# Altium schematic sheet SH11 - Battery Balancing.SchDoc: Active Cell Balancing Circuit
size 279 x 215 mm
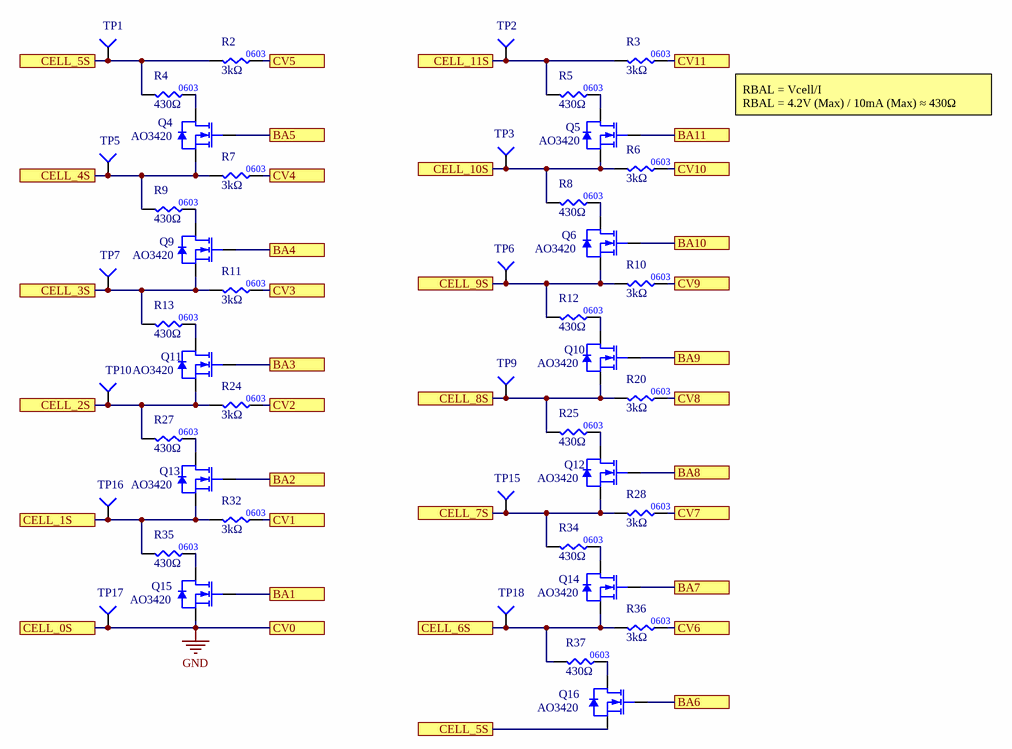
[diagram p0: SH11 - Battery Balancing.SchDoc]

## Parts
Q4  Manufacturer Part Number 1: AO3420  [SOT23-3]  (hidden comment: NMOS_20V_6A)
Q5  Manufacturer Part Number 1: AO3420  [SOT23-3]  (hidden comment: NMOS_20V_6A)
Q6  Manufacturer Part Number 1: AO3420  [SOT23-3]  (hidden comment: NMOS_20V_6A)
Q9  Manufacturer Part Number 1: AO3420  [SOT23-3]  (hidden comment: NMOS_20V_6A)
Q10  Manufacturer Part Number 1: AO3420  [SOT23-3]  (hidden comment: NMOS_20V_6A)
Q11  Manufacturer Part Number 1: AO3420  [SOT23-3]  (hidden comment: NMOS_20V_6A)
Q12  Manufacturer Part Number 1: AO3420  [SOT23-3]  (hidden comment: NMOS_20V_6A)
Q13  Manufacturer Part Number 1: AO3420  [SOT23-3]  (hidden comment: NMOS_20V_6A)
Q14  Manufacturer Part Number 1: AO3420  [SOT23-3]  (hidden comment: NMOS_20V_6A)
Q15  Manufacturer Part Number 1: AO3420  [SOT23-3]  (hidden comment: NMOS_20V_6A)
Q16  Manufacturer Part Number 1: AO3420  [SOT23-3]  (hidden comment: NMOS_20V_6A)
R2  value 3kΩ  [RES0603]  (hidden comment: RES_3kΩ_0603_1%)
R3  value 3kΩ  [RES0603]  (hidden comment: RES_3kΩ_0603_1%)
R4  value 430Ω  [RES0603]  (hidden comment: RES_430Ω_0603_5%)
R5  value 430Ω  [RES0603]  (hidden comment: RES_430Ω_0603_5%)
R6  value 3kΩ  [RES0603]  (hidden comment: RES_3kΩ_0603_1%)
R7  value 3kΩ  [RES0603]  (hidden comment: RES_3kΩ_0603_1%)
R8  value 430Ω  [RES0603]  (hidden comment: RES_430Ω_0603_5%)
R9  value 430Ω  [RES0603]  (hidden comment: RES_430Ω_0603_5%)
R10  value 3kΩ  [RES0603]  (hidden comment: RES_3kΩ_0603_1%)
R11  value 3kΩ  [RES0603]  (hidden comment: RES_3kΩ_0603_1%)
R12  value 430Ω  [RES0603]  (hidden comment: RES_430Ω_0603_5%)
R13  value 430Ω  [RES0603]  (hidden comment: RES_430Ω_0603_5%)
R20  value 3kΩ  [RES0603]  (hidden comment: RES_3kΩ_0603_1%)
R24  value 3kΩ  [RES0603]  (hidden comment: RES_3kΩ_0603_1%)
R25  value 430Ω  [RES0603]  (hidden comment: RES_430Ω_0603_5%)
R27  value 430Ω  [RES0603]  (hidden comment: RES_430Ω_0603_5%)
R28  value 3kΩ  [RES0603]  (hidden comment: RES_3kΩ_0603_1%)
R32  value 3kΩ  [RES0603]  (hidden comment: RES_3kΩ_0603_1%)
R34  value 430Ω  [RES0603]  (hidden comment: RES_430Ω_0603_5%)
R35  value 430Ω  [RES0603]  (hidden comment: RES_430Ω_0603_5%)
R36  value 3kΩ  [RES0603]  (hidden comment: RES_3kΩ_0603_1%)
R37  value 430Ω  [RES0603]  (hidden comment: RES_430Ω_0603_5%)
TP1  TESTPOINT_1MM_SQUARE  [TESTPOINT_SQUARE_1MM]  (value not drawn)  (no BOM)
TP2  TESTPOINT_1MM_SQUARE  [TESTPOINT_SQUARE_1MM]  (value not drawn)  (no BOM)
TP3  TESTPOINT_1MM_SQUARE  [TESTPOINT_SQUARE_1MM]  (value not drawn)  (no BOM)
TP5  TESTPOINT_1MM_SQUARE  [TESTPOINT_SQUARE_1MM]  (value not drawn)  (no BOM)
TP6  TESTPOINT_1MM_SQUARE  [TESTPOINT_SQUARE_1MM]  (value not drawn)  (no BOM)
TP7  TESTPOINT_1MM_SQUARE  [TESTPOINT_SQUARE_1MM]  (value not drawn)  (no BOM)
TP9  TESTPOINT_1MM_SQUARE  [TESTPOINT_SQUARE_1MM]  (value not drawn)  (no BOM)
TP10  TESTPOINT_1MM_SQUARE  [TESTPOINT_SQUARE_1MM]  (value not drawn)  (no BOM)
TP15  TESTPOINT_1MM_SQUARE  [TESTPOINT_SQUARE_1MM]  (value not drawn)  (no BOM)
TP16  TESTPOINT_1MM_SQUARE  [TESTPOINT_SQUARE_1MM]  (value not drawn)  (no BOM)
TP17  TESTPOINT_1MM_SQUARE  [TESTPOINT_SQUARE_1MM]  (value not drawn)  (no BOM)
TP18  TESTPOINT_1MM_SQUARE  [TESTPOINT_SQUARE_1MM]  (value not drawn)  (no BOM)

## Ports
BA1, BA2, BA3, BA4, BA5, BA6, BA7, BA8, BA9, BA10, BA11, CELL_0S, CELL_1S, CELL_2S, CELL_3S, CELL_4S, CELL_5S, CELL_6S, CELL_7S, CELL_8S, CELL_9S, CELL_10S, CELL_11S, CV0, CV1, CV2, CV3, CV4, CV5, CV6, CV7, CV8, CV9, CV10, CV11

## Nets
GND: Q15.2(SOURCE) TP17.1(=value) ; port CELL_0S, port CV0
BA1: Q15.1(GATE) ; port BA1
BA2: Q13.1(GATE) ; port BA2
BA3: Q11.1(GATE) ; port BA3
BA4: Q9.1(GATE) ; port BA4
BA5: Q4.1(GATE) ; port BA5
BA6: Q16.1(GATE) ; port BA6
BA7: Q14.1(GATE) ; port BA7
BA8: Q12.1(GATE) ; port BA8
BA9: Q10.1(GATE) ; port BA9
BA10: Q6.1(GATE) ; port BA10
BA11: Q5.1(GATE) ; port BA11
CELL_1S: Q13.2(SOURCE) R32.1 R35.1 TP16.1(=value) ; port CELL_1S
CELL_2S: Q11.2(SOURCE) R24.1 R27.1 TP10.1(=value) ; port CELL_2S
CELL_3S: Q9.2(SOURCE) R11.1 R13.1 TP7.1(=value) ; port CELL_3S
CELL_4S: Q4.2(SOURCE) R7.1 R9.1 TP5.1(=value) ; port CELL_4S
CELL_5S: Q16.2(SOURCE) R2.1 R4.1 TP1.1(=value) ; port CELL_5S
CELL_6S: Q14.2(SOURCE) R36.1 R37.1 TP18.1(=value) ; port CELL_6S
CELL_7S: Q12.2(SOURCE) R28.1 R34.1 TP15.1(=value) ; port CELL_7S
CELL_8S: Q10.2(SOURCE) R20.1 R25.1 TP9.1(=value) ; port CELL_8S
CELL_9S: Q6.2(SOURCE) R10.1 R12.1 TP6.1(=value) ; port CELL_9S
CELL_10S: Q5.2(SOURCE) R6.1 R8.1 TP3.1(=value) ; port CELL_10S
CELL_11S: R3.1 R5.1 TP2.1(=value) ; port CELL_11S
CV1: R32.2 ; port CV1
CV2: R24.2 ; port CV2
CV3: R11.2 ; port CV3
CV4: R7.2 ; port CV4
CV5: R2.2 ; port CV5
CV6: R36.2 ; port CV6
CV7: R28.2 ; port CV7
CV8: R20.2 ; port CV8
CV9: R10.2 ; port CV9
CV10: R6.2 ; port CV10
CV11: R3.2 ; port CV11
NetQ4_3: Q4.3(DRAIN) R4.2
NetQ5_3: Q5.3(DRAIN) R5.2
NetQ6_3: Q6.3(DRAIN) R8.2
NetQ9_3: Q9.3(DRAIN) R9.2
NetQ10_3: Q10.3(DRAIN) R12.2
NetQ11_3: Q11.3(DRAIN) R13.2
NetQ12_3: Q12.3(DRAIN) R25.2
NetQ13_3: Q13.3(DRAIN) R27.2
NetQ14_3: Q14.3(DRAIN) R34.2
NetQ15_3: Q15.3(DRAIN) R35.2
NetQ16_3: Q16.3(DRAIN) R37.2

## Notes on the sheet
- RBAL = Vcell/I
  RBAL = 4.2V (Max) / 10mA (Max) ≈ 430Ω
- University of Waterloo Robotics Team
- 200 University Ave W
- REV
- PROJECT
- Waterloo, Ontario, Canada
- N2L 3G1
- DOCUMENT
- ENGINEER
- REVIEWER
- MODIFIED
- SHEET
- OF
- (in symbol RES_3kΩ_0603_1%) 0603

## Library data of the parts
Q4-Q6 Q9-Q16 = NMOS_20V_6A: MOSFET N-CH 20V 6A SOT-23; Manufacturer 1: Alpha & Omega; Supplier 1: Digi-Key; Supplier Part Number 1: 785-1014-2-ND
R2 R3 R6 R7 R10 R11 R20 R24 R28 R32 R36 = RES_3kΩ_0603_1%: RES 3K OHM 1% 1/10W 0603; Manufacturer 1: Yageo; Manufacturer Part Number 1: RC0603FR-073KL; Supplier 1: Digi-Key; Supplier Part Number 1: 311-3.00KHRCT-ND
R4 R5 R8 R9 R12 R13 R25 R27 R34 R35 R37 = RES_430Ω_0603_5%: RES 430 OHM 5% 1/10W 0603; Manufacturer 1: Stackpole Electronics; Manufacturer Part Number 1: RMCF0603JT430R; Package/Footprint: 0603; Supplier Part Number 1: RMCF0603JT430R; Supplier 1: Digi-Key; Mounting Type: SMD
TP1 = TESTPOINT_1MM_SQUARE: CELL5
TP2 = TESTPOINT_1MM_SQUARE: CELL11
TP3 = TESTPOINT_1MM_SQUARE: CELL10
TP5 = TESTPOINT_1MM_SQUARE: CELL4
TP6 = TESTPOINT_1MM_SQUARE: CELL9
TP7 = TESTPOINT_1MM_SQUARE: CELL3
TP9 = TESTPOINT_1MM_SQUARE: CELL8
TP10 = TESTPOINT_1MM_SQUARE: CELL2
TP15 = TESTPOINT_1MM_SQUARE: CELL7
TP16 = TESTPOINT_1MM_SQUARE: CELL1
TP17 = TESTPOINT_1MM_SQUARE: CELL0
TP18 = TESTPOINT_1MM_SQUARE: CELL6